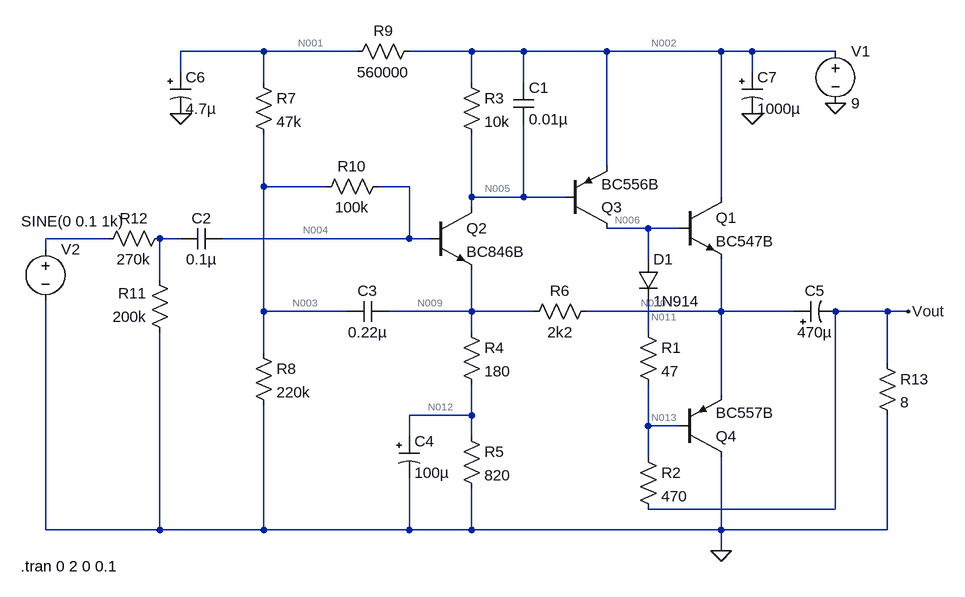
[diagram p0: schematic amp_basico.asc]
amp_basico.asc, the LTspice schematic file:
Version 4
SHEET 1 880 680
WIRE -256 -272 -384 -272
WIRE -112 -272 -256 -272
WIRE 64 -272 -32 -272
WIRE 144 -272 64 -272
WIRE 272 -272 144 -272
WIRE 448 -272 272 -272
WIRE 496 -272 448 -272
WIRE 624 -272 496 -272
WIRE -384 -240 -384 -272
WIRE 496 -240 496 -272
WIRE -256 -224 -256 -272
WIRE 64 -224 64 -272
WIRE 144 -224 144 -272
WIRE 272 -96 272 -272
WIRE -256 -64 -256 -144
WIRE -160 -64 -256 -64
WIRE -32 -64 -80 -64
WIRE 64 -48 64 -144
WIRE 144 -48 144 -160
WIRE 144 -48 64 -48
WIRE 208 -48 144 -48
WIRE 448 -48 448 -272
WIRE 64 -32 64 -48
WIRE 336 0 272 0
WIRE 384 0 336 0
WIRE -496 16 -592 16
WIRE -384 16 -416 16
WIRE -32 16 -32 -64
WIRE -32 16 -320 16
WIRE 0 16 -32 16
WIRE -592 32 -592 16
WIRE 336 48 336 0
WIRE -416 80 -416 16
WIRE -256 128 -256 -64
WIRE -128 128 -256 128
WIRE 64 128 64 64
WIRE 64 128 -64 128
WIRE 160 128 64 128
WIRE 448 128 448 48
WIRE 448 128 240 128
WIRE 560 128 448 128
WIRE 704 128 624 128
WIRE 736 128 704 128
WIRE 64 160 64 128
WIRE 336 160 336 112
WIRE -256 192 -256 128
WIRE 704 208 704 128
WIRE 448 256 448 128
WIRE 64 288 64 240
WIRE 64 288 -32 288
WIRE 336 304 336 240
WIRE 384 304 336 304
WIRE -32 320 -32 288
WIRE 64 320 64 288
WIRE 336 352 336 304
WIRE 624 432 624 128
WIRE 624 432 336 432
WIRE -592 464 -592 112
WIRE -416 464 -416 160
WIRE -416 464 -592 464
WIRE -256 464 -256 272
WIRE -256 464 -416 464
WIRE -32 464 -32 384
WIRE -32 464 -256 464
WIRE 64 464 64 400
WIRE 64 464 -32 464
WIRE 448 464 448 352
WIRE 448 464 64 464
WIRE 704 464 704 288
WIRE 704 464 448 464
WIRE 448 496 448 464
FLAG 448 496 0
FLAG 736 128 Vout
FLAG 624 -192 0
FLAG 496 -176 0
FLAG -384 -176 0
SYMBOL npn 384 -48 R0
SYMATTR InstName Q1
SYMATTR Value BC547B
SYMBOL npn 0 -32 R0
SYMATTR InstName Q2
SYMATTR Value BC846B
SYMBOL pnp 208 0 M180
SYMATTR InstName Q3
SYMATTR Value BC556B
SYMBOL pnp 384 352 M180
SYMATTR InstName Q4
SYMATTR Value BC557B
SYMBOL res 320 144 R0
SYMATTR InstName R1
SYMATTR Value 47
SYMBOL diode 320 48 R0
SYMATTR InstName D1
SYMATTR Value 1N914
SYMBOL res 320 336 R0
SYMATTR InstName R2
SYMATTR Value 470
SYMBOL res 48 -240 R0
SYMATTR InstName R3
SYMATTR Value 10k
SYMBOL cap 128 -224 R0
SYMATTR InstName C1
SYMATTR Value 0.01µ
SYMBOL res 48 144 R0
SYMATTR InstName R4
SYMATTR Value 180
SYMBOL res 48 304 R0
SYMATTR InstName R5
SYMATTR Value 820
SYMBOL res 256 112 R90
WINDOW 0 0 56 VBottom 2
WINDOW 3 32 56 VTop 2
SYMATTR InstName R6
SYMATTR Value 2k2
SYMBOL res -272 -240 R0
SYMATTR InstName R7
SYMATTR Value 47k
SYMBOL res -272 176 R0
SYMATTR InstName R8
SYMATTR Value 220k
SYMBOL res -16 -288 R90
WINDOW 0 0 56 VBottom 2
WINDOW 3 32 56 VTop 2
SYMATTR InstName R9
SYMATTR Value 560000
SYMBOL res -64 -80 R90
WINDOW 0 0 56 VBottom 2
WINDOW 3 32 56 VTop 2
SYMATTR InstName R10
SYMATTR Value 100k
SYMBOL res -400 176 R180
WINDOW 0 36 76 Left 2
WINDOW 3 36 40 Left 2
SYMATTR InstName R11
SYMATTR Value 200k
SYMBOL cap -320 0 R90
WINDOW 0 0 32 VBottom 2
WINDOW 3 32 32 VTop 2
SYMATTR InstName C2
SYMATTR Value 0.1µ
SYMBOL cap -64 112 R90
WINDOW 0 0 32 VBottom 2
WINDOW 3 32 32 VTop 2
SYMATTR InstName C3
SYMATTR Value 0.22µ
SYMBOL polcap -48 320 R0
WINDOW 3 24 56 Left 2
SYMATTR InstName C4
SYMATTR Value 100µ
SYMATTR Description Capacitor
SYMATTR Type cap
SYMATTR SpiceLine V=25 Irms=370m Rser=0.24 Lser=0 mfg="Nichicon" pn="UPL1E101MPH" type="Al electrolytic"
SYMBOL polcap 560 144 R270
WINDOW 0 32 32 VTop 2
WINDOW 3 0 32 VBottom 2
SYMATTR InstName C5
SYMATTR Value 470µ
SYMATTR Description Capacitor
SYMATTR Type cap
SYMATTR SpiceLine V=35 Irms=750m Rser=0.16 Lser=0 mfg="Nichicon" pn="UPG1V471MRH" type="Al electrolytic"
SYMBOL voltage 624 -288 R0
WINDOW 123 0 0 Left 2
WINDOW 39 0 0 Left 2
SYMATTR InstName V1
SYMATTR Value 9
SYMBOL voltage -592 16 R0
WINDOW 3 -37 -27 Left 2
WINDOW 123 0 0 Left 2
WINDOW 39 0 0 Left 2
SYMATTR InstName V2
SYMATTR Value SINE(0 0.1 1k)
SYMBOL polcap -400 -240 R0
WINDOW 3 24 56 Left 2
SYMATTR InstName C6
SYMATTR Value 4.7µ
SYMATTR Description Capacitor
SYMATTR Type cap
SYMATTR SpiceLine V=50 Irms=170m Rser=1 Lser=0 mfg="Nichicon" pn="UPG1H4R7MPH" type="Al electrolytic"
SYMBOL polcap 480 -240 R0
WINDOW 3 24 56 Left 2
SYMATTR InstName C7
SYMATTR Value 1000µ
SYMATTR Description Capacitor
SYMATTR Type cap
SYMATTR SpiceLine V=25 Irms=855m Rser=0.1 Lser=0 mfg="Nichicon" pn="UPR1E102MRH" type="Al electrolytic"
SYMBOL res -400 0 R90
WINDOW 0 0 56 VBottom 2
WINDOW 3 32 56 VTop 2
SYMATTR InstName R12
SYMATTR Value 270k
SYMBOL res 688 192 R0
SYMATTR InstName R13
SYMATTR Value 8
TEXT -630 520 Left 2 !.tran 0 2 0 0.1

The netlist it stands for:
* amp_basico.asc
Q1 N002 N006 N010 0 BC547B
Q2 N005 N004 N009 0 BC846B
Q3 N006 N005 N002 0 BC556B
Q4 0 N013 N010 0 BC557B
R1 N011 N013 47
D1 N006 N011 1N914
R2 N013 Vout 470
R3 N002 N005 10k
C1 N002 N005 0.01µ
R4 N009 N012 180
R5 N012 0 820
R6 N010 N009 2k2
R7 N001 N003 47k
R8 N003 0 220k
R9 N002 N001 560000
R10 N004 N003 100k
R11 0 N008 200k
C2 N004 N008 0.1µ
C3 N009 N003 0.22µ
C4 N012 0 100µ V=25 Irms=370m Rser=0.24 Lser=0 mfg="Nichicon" pn="UPL1E101MPH" type="Al electrolytic"
C5 N010 Vout 470µ V=35 Irms=750m Rser=0.16 Lser=0 mfg="Nichicon" pn="UPG1V471MRH" type="Al electrolytic"
V1 N002 0 9
V2 N007 0 SINE(0 0.1 1k)
C6 N001 0 4.7µ V=50 Irms=170m Rser=1 Lser=0 mfg="Nichicon" pn="UPG1H4R7MPH" type="Al electrolytic"
C7 N002 0 1000µ V=25 Irms=855m Rser=0.1 Lser=0 mfg="Nichicon" pn="UPR1E102MRH" type="Al electrolytic"
R12 N008 N007 270k
R13 Vout 0 8
.model D D
.lib standard.dio
.model NPN NPN
.model PNP PNP
.lib standard.bjt
.tran 0 2 0 0.1
.backanno
.end

* Results of the author's LTspice run, read from the files saved beside the schematic
* Operating Point, zero values left out:
*   V(n002) = 9 V
*   V(n006) = 6.003 V
*   V(n010) = 5.351 V
*   V(n005) = 8.307 V
*   V(n004) = 2.316 V
*   V(n009) = 1.741 V
*   V(n013) = 4.833 V
*   V(n011) = 5.308 V
*   V(vout) = 80.88 mV
*   V(n012) = 1.428 V
*   V(n001) = 2.861 V
*   V(n003) = 2.346 V
*   Ic(Q4) = -20.21 µA
*   Ib(Q4) = -54.49 nA
*   Ie(Q4) = 20.26 µA
*   Ic(Q3) = -10.12 mA
*   Ib(Q3) = -30.56 µA
*   Ie(Q3) = 10.15 mA
*   Ic(Q2) = 99.83 µA
*   Ib(Q2) = 298.2 nA
*   Ie(Q2) = -100.1 µA
*   Ic(Q1) = 1.656 mA
*   Ib(Q1) = 5.612 µA
*   Ie(Q1) = -1.661 mA
*   I(D1) = 10.11 mA
*   I(R13) = 10.11 mA
*   I(R10) = -298.2 nA
*   I(R9) = 10.96 µA
*   I(R8) = 10.66 µA
*   I(R7) = 10.96 µA
*   I(R6) = 1.641 mA
*   I(R5) = 1.741 mA
*   I(R4) = 1.741 mA
*   I(R3) = 69.27 µA
*   I(R2) = 10.11 mA
*   I(R1) = 10.11 mA
*   I(V1) = -11.88 mA